# EAGLE design Schematicauto (EAGLE 7.7.0)
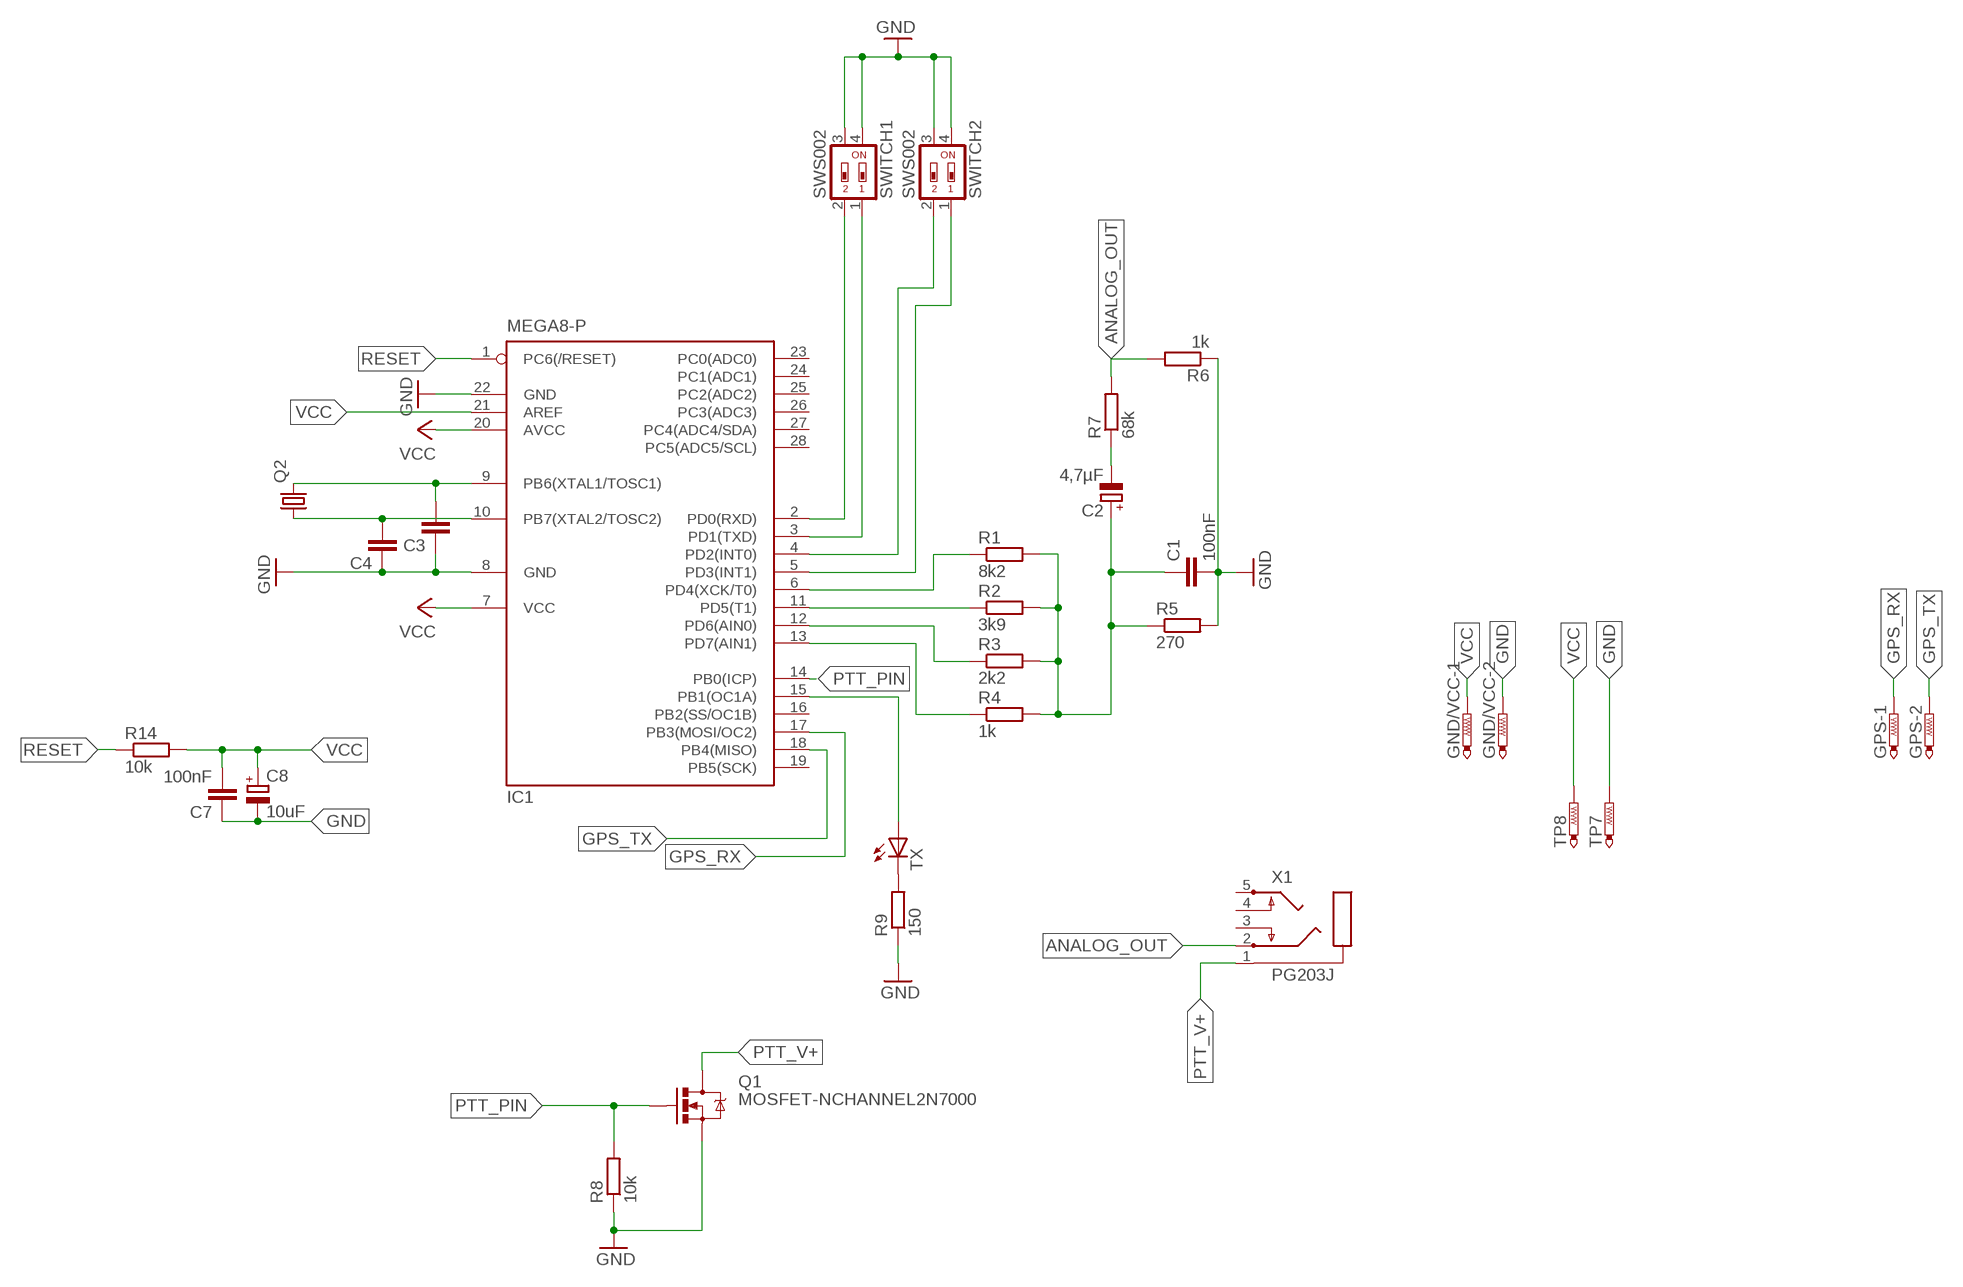
[diagram p0: schematic, sheet 1]

## Parts
C1  100nF  C-EU025-025X050  [C025-025X050]
C2  4,7µF  CPOL-EUE2-4  [E2-4]
C3  C-EU025-025X050  [C025-025X050]
C4  C-EU025-025X050  [C025-025X050]
C7  100nF  C-EU050-030X075  [C050-030X075]
C8  10uF  CPOL-EUTT5D9  [TT5D9]
GND/VCC  PTR2  [P2-38-17]
GPS  PTR2  [P2-38-17]
IC1  MEGA8-P  [DIL28-3]
Q1  MOSFET-NCHANNEL2N7000  [TO-92]
Q2  CRYSTALHC49S  [HC49/S]
R1  8k2  R-EU_0207/12  [0207/12]
R2  3k9  R-EU_0207/12  [0207/12]
R3  2k2  R-EU_0207/12  [0207/12]
R4  1k  R-EU_0207/12  [0207/12]
R5  270  R-EU_0207/12  [0207/12]
R6  1k  R-EU_0207/12  [0207/12]
R7  68k  R-EU_0207/12  [0207/12]
R8  10k  R-EU_0207/12  [0207/12]
R9  150  R-EU_0207/12  [0207/12]
R14  10k  R-EU_0207/12  [0207/12]
SWITCH1  SWS002  [SMS-002]
SWITCH2  SWS002  [SMS-002]
TP7  PTR1PAD1-20Y  [P1-20Y]
TP8  PTR1PAD1-20Y  [P1-20Y]
TX  LED5MM  [LED5MM]
X1  PG203J  [PG203J]

## Nets
ANALOG_OUT: R6.2 R7.2 X1.2
GND: C1.2 C3.1 C4.1 C7.1 C8.- GND/VCC.TP-2 IC1.8(GND) IC1.22(GND) Q1.1(S) R5.2 R6.1 R8.1 R9.1 SWITCH1.3 SWITCH1.4 SWITCH2.3 SWITCH2.4 TP7.TP
GPS_RX: GPS.TP-1 IC1.17(PB3(MOSI/OC2))
GPS_TX: GPS.TP-2 IC1.18(PB4(MISO))
N$1: IC1.6(PD4(XCK/T0)) R1.1
N$2: IC1.11(PD5(T1)) R2.1
N$3: IC1.12(PD6(AIN0)) R3.1
N$4: IC1.13(PD7(AIN1)) R4.1
N$5: C1.1 C2.+ R1.2 R2.2 R3.2 R4.2 R5.1
N$6: C2.- R7.1
N$7: IC1.15(PB1(OC1A)) TX.A
N$8: IC1.2(PD0(RXD)) SWITCH1.2
N$9: IC1.3(PD1(TXD)) SWITCH1.1
N$10: R9.2 TX.K(C)
N$11: IC1.4(PD2(INT0)) SWITCH2.2
N$12: IC1.5(PD3(INT1)) SWITCH2.1
N$13: C4.2 IC1.10(PB7(XTAL2/TOSC2)) Q2.1
N$14: C3.2 IC1.9(PB6(XTAL1/TOSC1)) Q2.2
PTT_PIN: IC1.14(PB0(ICP)) Q1.2(G) R8.2
PTT_V+: Q1.3(D) X1.1
RESET: IC1.1(PC6(/RESET)) R14.1
VCC: C7.2 C8.+ GND/VCC.TP-1 IC1.7(VCC) IC1.20(AVCC) IC1.21(AREF) R14.2 TP8.TP
Unconnected: IC1.16(PB2(SS/OC1B)) IC1.19(PB5(SCK)) IC1.23(PC0(ADC0)) IC1.24(PC1(ADC1)) IC1.25(PC2(ADC2)) IC1.26(PC3(ADC3)) IC1.27(PC4(ADC4/SDA)) IC1.28(PC5(ADC5/SCL)) X1.3 X1.4 X1.5

## Library data of the parts
C1 C3 C4 = rcl:C-EU: CAPACITOR, European symbol
C2 C8 = rcl:CPOL-EU: POLARIZED CAPACITOR, European symbol
C7 = resistor:C-EU: CAPACITOR, European symbol
GND/VCC GPS = testpad:PTR2: TEST PIN
IC1 = atmel:MEGA8-P: MICROCONTROLLER 8 Kbytes FLASH, 1 kbytes SRAM, 512 bytes EEPROM, USART, 4-channel 10 bit ADC, 2-channel 8 bit ADC Pin compatible with Atmega48, ATMega88, ATMega168 Source: avr.lbr; OC_FARNELL: unknown; OC_NEWARK: unknown
Q1 = SparkFun-DiscreteSemi:MOSFET-NCHANNEL: Common NMOSFET Parts MFG P/N Store ID Prod ID FDD8780 TRANS-09984 SI7820DN TRANS-11055 FDS6630A IC-08089 2N7002PW TRANS-11151 FQP30N06L COM-10213 TRANS-10060 BSS123LT1G TRANS-08345 BSS138 TRANS-00830 BS170 2N7000
Q2 = crystal:CRYSTAL: CRYSTAL; OC_FARNELL: 1667008; OC_NEWARK: unknown
R1-R8 = rcl:R-EU_: RESISTOR, European symbol
R9 R14 = resistor:R-EU_: RESISTOR, European symbol
SWITCH1 SWITCH2 = smd-special:SWS002: SMD Dip Switch 2 pol.
TP7 TP8 = testpad:PTR1: TEST PIN
TX = led:LED: LED OSRAM: - CHIPLED LG R971, LG N971, LY N971, LG Q971, LY Q971, LO R971, LY R971 LH N974, LH R974 LS Q976, LO Q976, LY Q976 LO Q996 - Hyper CHIPLED LW Q18S LB Q993, LB Q99A, LB R99A - SideLED LS A670, LO A670, LY A670, LG A670, LP A670 LB A673, LV A673, LT A673, LW A673 LH A674 LY A675 LS A676, LA A676, LO A676, LY A676, LW A676 LS A679, LY A679, LG A679 - Hyper Micro SIDELED® LS Y876, LA Y876, LO Y876, LY Y876 LT Y87S - SmartLED LW L88C, LW L88S LB L89C, LB L89S, LG L890 LS L89K, LO L89K, LY L89K LS L896, LA L896, LO L896, LY L896 - TOPLED LS T670, LO T670, LY T670, LG T670, LP T670 LSG T670, LSP T670, LSY T670, LOP T670, LYG T670 LG T671, LOG T671, LSG T671 LB T673, LV T673, LT T673, LW T673 LH T674 LS T676, LA T676, LO T676, LY T676, LB T676, LH T676, LSB T676, LW T676 LB T67C, LV T67C, LT T67C, LS T67K, LO T67K, LY T67K, LW E67C LS E67B, LA E67B, LO E67B, LY E67B, LB E67C, LV E67C, LT E67C LW T67C LS T679, LY T679, LG T679 LS T770, LO T770, LY T770, LG T770, LP T770 LB T773, LV T773, LT T773, LW T773 LH T774 LS E675, LA E675, LY E675, LS T675 LS T776, LA T776, LO T776, LY T776, LB T776 LHGB T686 LT T68C, LB T68C - Hyper Mini TOPLED® LB M676 - Mini TOPLED Santana® LG M470 LS M47K, LO M47K, LY M47K Source: http://www.osram.convergy.de LUXEON: - LUMILED® LXK2-PW12-R00, LXK2-PW12-S00, LXK2-PW14-U00, LXK2-PW14-V00 LXK2-PM12-R00, LXK2-PM12-S00, LXK2-PM14-U00 LXK2-PE12-Q00, LXK2-PE12-R00, LXK2-PE12-S00, LXK2-PE14-T00, LXK2-PE14-U00 LXK2-PB12-K00, LXK2-PB12-L00, LXK2-PB12-M00, LXK2-PB14-N00, LXK2-PB14-P00, LXK2-PB14-Q00 LXK2-PR12-L00, LXK2-PR12-M00, LXK2-PR14-Q00, LXK2-PR14-R00 LXK2-PD12-Q00, LXK2-PD12-R00, LXK2-PD12-S00 LXK2-PH12-R00, LXK2-PH12-S00 LXK2-PL12-P00, LXK2-PL12-Q00, LXK2-PL12-R00 Source: www.luxeon.com KINGBRIGHT: KA-3528ASYC Source: www.kingbright.com
X1 = con-hirschmann:PG203J: MIC/HEADPHONE JACK KS-S stereo microphone/headphone jack PG203JN (Schukat); OC_FARNELL: unknown; OC_NEWARK: unknown

## Board
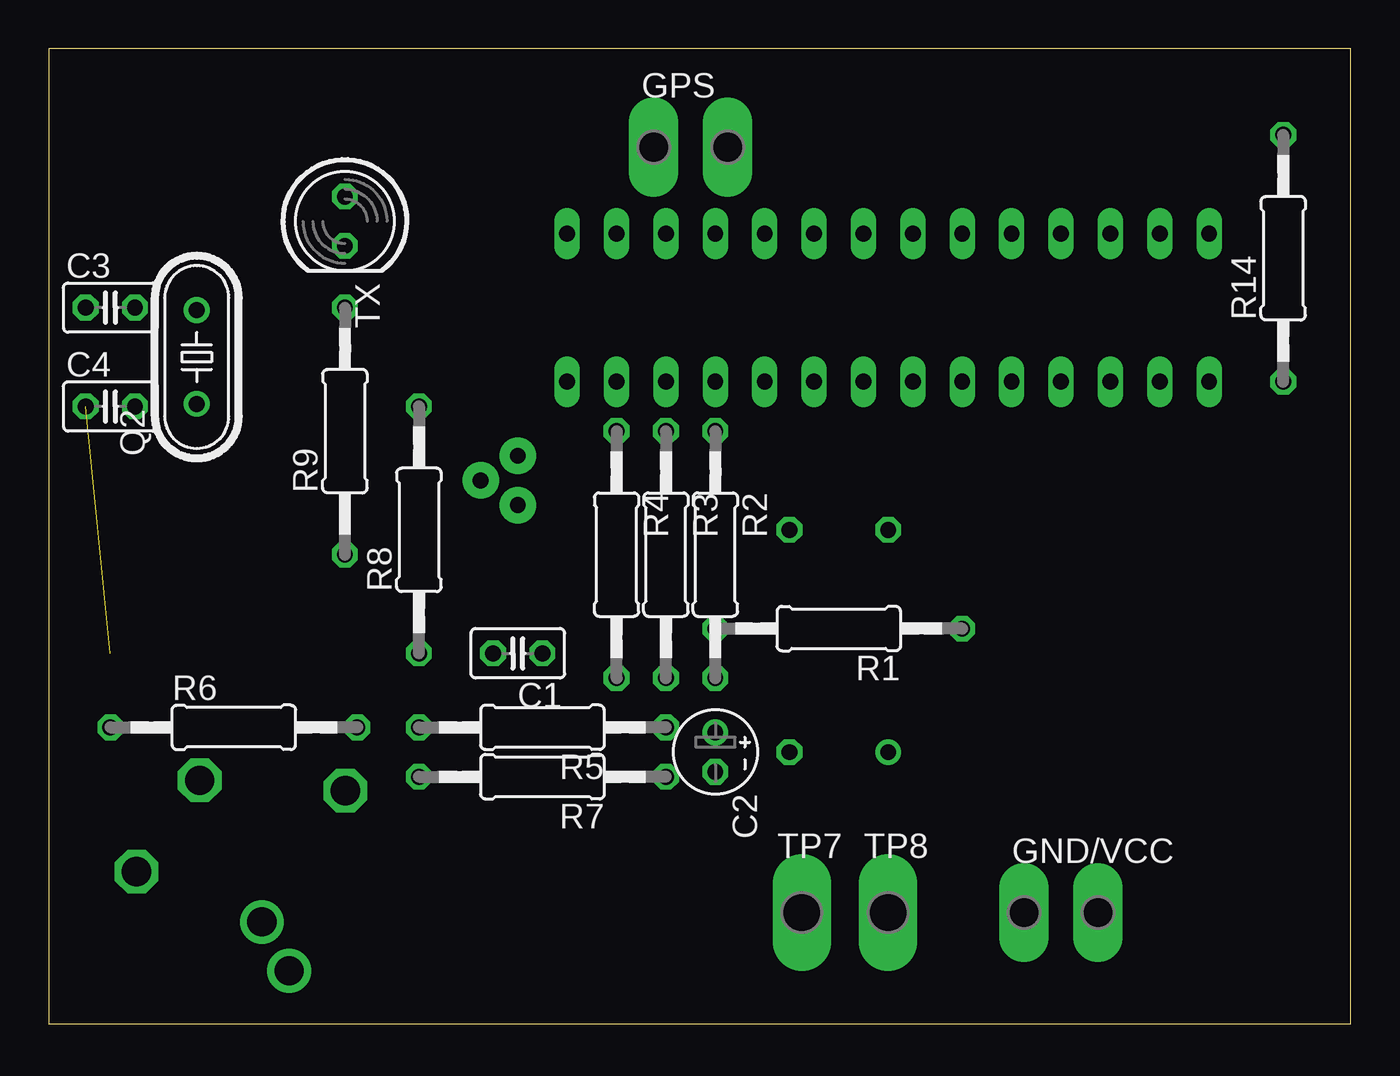
[diagram p1: board, top side]
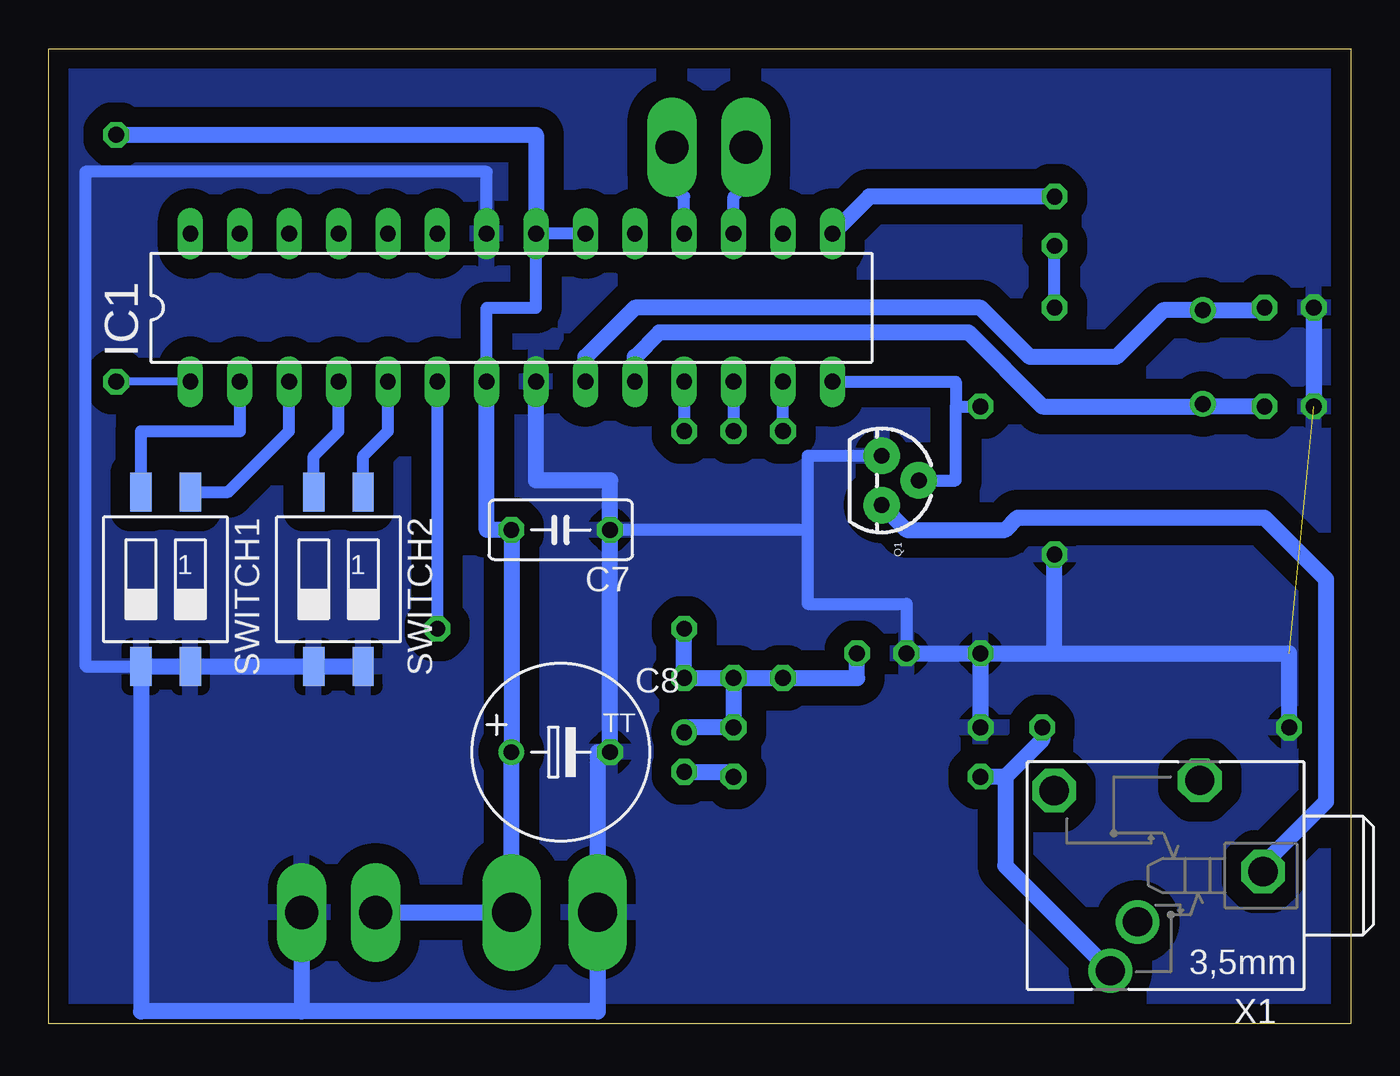
[diagram p2: board, bottom side, seen from below]

Size 66.98 x 50.16 mm. Coordinates in mm from the lower left corner, seen from the top.
Outline: 0,0 66.98,0 66.98,50.16 0,50.16 0,0
Copper layers (1*16): Top 0.035mm / dielectric 1.5mm / Bottom 0.035mm
Design rules "default *": minimum track width 10mil, minimum drill 24mil, track to track 8mil, track to pad 8mil, pad to pad 8mil, via to via 8mil, smd to smd 8mil, copper to edge 40mil, drill to drill 10mil, minimum pad ring 10mil, minimum via ring 8mil, stop-mask expansion 4mil, vias tented up to drill 0mil, thermal gap 18mil

### Footprints (pad centres in the part's own frame; a part is rotated, then mirrored left to right if it is on the bottom)
C025-025X050 = drill 0.813 octagon: 1 -1.27,0; 2 1.27,0
E2-4 = drill 0.813 pad 1.27: + -1.016,0 | drill 0.813 pad 1.27 octagon: - 1.016,0
C050-030X075 = drill 0.813 octagon: 1 -2.54,0; 2 2.54,0
TT5D9 = drill 0.813: + -2.54,0 | drill 0.813 octagon: - 2.54,0
P2-38-17 = drill 1.702 pad 2.121 long: TP-1 -1.905,0; TP-2 1.905,0
DIL28-3 = drill 0.813 long: 1 -16.51,-3.81; 2 -13.97,-3.81; 3 -11.43,-3.81; 4 -8.89,-3.81; 5 -6.35,-3.81; 6 -3.81,-3.81; 7 -1.27,-3.81; 8 1.27,-3.81; 9 3.81,-3.81; 10 6.35,-3.81; 11 8.89,-3.81; 12 11.43,-3.81; 13 13.97,-3.81; 14 16.51,-3.81; 15 16.51,3.81; 16 13.97,3.81; 17 11.43,3.81; 18 8.89,3.81; 19 6.35,3.81; 20 3.81,3.81; 21 1.27,3.81; 22 -1.27,3.81; 23 -3.81,3.81; 24 -6.35,3.81; 25 -8.89,3.81; 26 -11.43,3.81; 27 -13.97,3.81; 28 -16.51,3.81
TO-92 = drill 0.813 pad 1.88: 1 -1.27,0; 2 0,1.905; 3 1.27,0
HC49/S = drill 0.813: 1 -2.413,0; 2 2.413,0
0207/12 = drill 0.813 octagon: 1 -6.35,0; 2 6.35,0
SMS-002 = smd 1.092 x 2.007: 1 -1.27,-4.496; 2 1.27,-4.496; 3 1.27,4.496; 4 -1.27,4.496
P1-20Y = drill 2.007 pad 2.54 long: TP 0,0
LED5MM = drill 0.813 octagon: A -1.27,0; K 1.27,0
PG203J = drill 1.499 octagon: 1 -5.004,-0.203; 4 5.74,-4.369; 5 -1.753,-4.902 | drill 1.499: 2 2.845,4.902; 3 1.448,2.388

### Placement (x,y rotation side)
C1  24.13,19.05 180 top
C2  34.29,13.97 270 top
C3  3.17,36.83 0 top
C4  3.17,31.75 0 top
C7  40.64,25.4 180 bottom
C8  40.64,13.97 0 bottom
GND/VCC  52.07,5.71 0 top
GPS  33.02,45.09 0 top
IC1  43.18,36.83 0 bottom
Q1  24.13,27.94 270 bottom
Q2  7.62,34.29 90 top
R1  40.64,20.32 180 top
R2  34.29,24.13 270 top
R3  31.75,24.13 270 top
R4  29.21,24.13 270 top
R5  25.4,15.24 180 top
R6  9.53,15.24 0 top
R7  25.4,12.7 180 top
R8  19.05,25.4 90 top
R9  15.24,30.48 90 top
R14  63.5,39.37 90 top
SWITCH1  60.96,22.86 180 bottom
SWITCH2  52.07,22.86 180 bottom
TP7  38.73,5.71 0 top
TP8  43.18,5.71 0 top
TX  15.24,41.27 270 top
X1  9.53,7.62 180 bottom

### Tracks (layer width: path | path; a pad name or v marks a point on that pad's centre or on a via)
ANALOG_OUT
  Bottom 0.813: R6.2 15.88,14.61 17.78,12.7 | 17.78,12.7 R7.2 | 17.78,12.7 17.78,8.13 X1.2
GND  (1 unrouted)
  Bottom 0.61: Q1.1 27.94,29.21 27.94,25.4 | 27.94,25.4 C7.1 | 27.94,25.4 27.94,21.59 22.86,21.59 C1.2 | 38.73,13.97 C8.- | IC1.22 44.45,43.81 65.09,43.81 65.09,18.41 65.04,18.36 SWITCH1.3
  Bottom 0.813: C8.- C7.1 38.1,27.94 41.91,27.94 IC1.8 | C1.2 R8.1 | R8.1 R5.2 | R6.1 3.17,19.05 R8.1 | SWITCH2.4 SWITCH2.3 SWITCH1.4 SWITCH1.3 62.23,0.64 53.98,0.64 | 53.98,0.64 38.73,0.64 TP7.TP 38.73,13.97 | GND/VCC.TP-2 53.98,0.64 | R8.1 15.24,19.05 R9.1 | C3.1 C4.1
  pour Bottom (isolate 1.016): 0,50.16 66.67,50.16 66.67,0 0,0
GPS_RX
  Bottom 0.61: IC1.17 31.75,42.55 31.11,43.18 GPS.TP-1
GPS_TX
  Bottom 0.61: IC1.18 34.29,42.55 34.92,43.18 GPS.TP-2
N$1
  Bottom 0.61: IC1.6 R1.1
N$2
  Bottom 0.61: IC1.11 R2.1
N$3
  Bottom 0.61: IC1.12 R3.1
N$4
  Bottom 0.61: R4.1 IC1.13
N$5
  Bottom 0.813: R3.2 R2.2 R1.2 | R3.2 R5.1 34.29,15.24 C2.+ | R3.2 R4.2 25.4,17.78 C1.1
N$6
  Bottom 0.813: C2.- 31.75,12.95 R7.1
N$7
  Bottom 0.813: TX.A 24.77,42.55 IC1.15
N$8
  Bottom 0.61: IC1.2 57.15,30.48 62.23,30.48 SWITCH1.2
N$9
  Bottom 0.61: SWITCH1.1 57.73,27.36 54.61,30.48 IC1.3
N$10
  Bottom 0.61: R9.2 TX.K
N$11
  Bottom 0.61: SWITCH2.2 53.34,29.21 52.07,30.48 IC1.4
N$12
  Bottom 0.61: SWITCH2.1 50.8,29.21 49.53,30.48 IC1.5
N$13
  Bottom 0.813: IC1.10 36.83,34.29 35.56,35.56 19.68,35.56 15.88,31.75 7.75,31.75 Q2.1 7.49,31.75 C4.2
N$14
  Bottom 0.813: IC1.9 39.37,34.29 36.83,36.83 19.05,36.83 16.51,34.29 12.06,34.29 9.65,36.7 Q2.2 4.57,36.7 C3.2
PTT_PIN
  Bottom 0.61: Q1.2 20.32,27.94 20.32,31.75 | 20.32,31.75 R8.2 | IC1.14 20.32,33.02 20.32,31.75
PTT_V+
  Bottom 0.813: X1.1 4.52,8.18 1.27,11.43 1.27,22.86 4.45,26.04 17.14,26.04 17.78,25.4 22.86,25.4 Q1.3
RESET
  Bottom 0.406: IC1.1 R14.1
VCC
  Bottom 0.61: IC1.20 IC1.21 41.91,36.83 44.45,36.83 IC1.7
  Bottom 0.813: IC1.7 44.45,25.4 C7.2 C8.+ TP8.TP GND/VCC.TP-1 | R14.2 41.91,45.72 IC1.21